# Altium schematic sheet Connectors.SchDoc
size A4 portrait
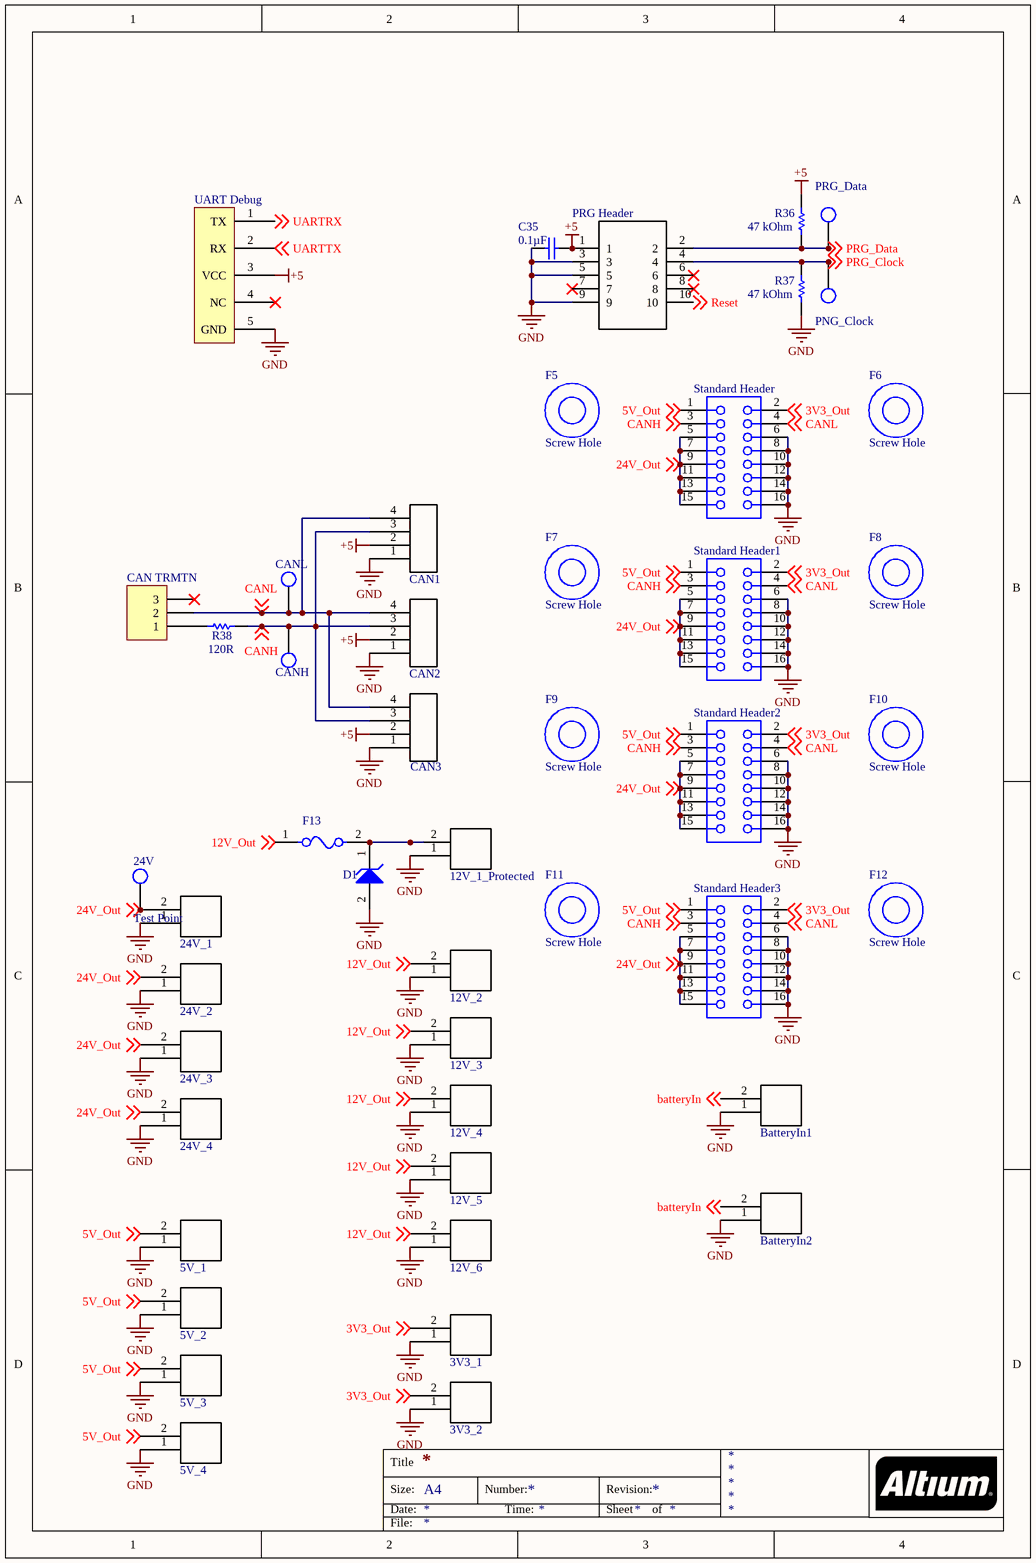
[diagram p0: Connectors.SchDoc]

## Parts
3V3_1  Molex 6.5MM  power connector  [power connector]  (value not drawn)
3V3_2  Molex 6.5MM  power connector  [power connector]  (value not drawn)
5V_1  Molex 6.5MM  power connector  [power connector]  (value not drawn)
5V_2  Molex 6.5MM  power connector  [power connector]  (value not drawn)
5V_3  Molex 6.5MM  power connector  [power connector]  (value not drawn)
5V_4  Molex 6.5MM  power connector  [power connector]  (value not drawn)
12V_1_Protected  Molex 6.5MM  power connector  [power connector]  (value not drawn)
12V_2  Molex 6.5MM  power connector  [power connector]  (value not drawn)
12V_3  Molex 6.5MM  power connector  [power connector]  (value not drawn)
12V_4  Molex 6.5MM  power connector  [power connector]  (value not drawn)
12V_5  Molex 6.5MM  power connector  [power connector]  (value not drawn)
12V_6  Molex 6.5MM  power connector  [power connector]  (value not drawn)
24V  Test Point  [Test Point Through-hole]
24V_1  Molex 6.5MM  power connector  [power connector]  (value not drawn)
24V_2  Molex 6.5MM  power connector  [power connector]  (value not drawn)
24V_3  Molex 6.5MM  power connector  [power connector]  (value not drawn)
24V_4  Molex 6.5MM  power connector  [power connector]  (value not drawn)
BatteryIn1  Super Saber  [Super Sabre]  (value not drawn)
BatteryIn2  Super Saber  [Super Sabre]  (value not drawn)
C35  Capacitance: 0.1µF  [Cap 0805]  (hidden comment: Capacitor 0805)
CAN1  Molex Micro  [microfit 4 pin]  (value not drawn)
CAN2  Molex Micro  [microfit 4 pin]  (value not drawn)
CAN3  Molex Micro  [microfit 4 pin]  (value not drawn)
CAN_TRMTN  Header 3  [HDR1X3]  (value not drawn)
CANH  Test Point  [Test Point Through-hole]  (value not drawn)
CANL  Test Point  [Test Point Through-hole]  (value not drawn)
D1  1SMB5928BT3G  [ONSC-SMB-2-403A-03_H_V]  (value not drawn)
F5  Screw Hole  [Screw Hole]
F6  Screw Hole  [Screw Hole]
F7  Screw Hole  [Screw Hole]
F8  Screw Hole  [Screw Hole]
F9  Screw Hole  [Screw Hole]
F10  Screw Hole  [Screw Hole]
F11  Screw Hole  [Screw Hole]
F12  Screw Hole  [Screw Hole]
F13  015402.5DRT  [FP-0154-MFG]  (value not drawn)
PNG_Clock  Test Point  [Test Point Through-hole]  (value not drawn)
PRG_Data  Test Point  [Test Point Through-hole]  (value not drawn)
PRG_Header  Programming Header  [programming3D]  (value not drawn)
R36  value 47 kOhm  [RESC0805(2012)_N]  (hidden comment: Resistor 0805)
R37  value 47 kOhm  [RESC0805(2012)_N]  (hidden comment: Resistor 0805)
R38  value 120R  [RESC0805(2012)_N]  (hidden comment: Resistor 0805)
Standard_Header  Stacking Header  [SMTC-SSQ-108-02-X-D]  (value not drawn)
Standard_Header1  Stacking Header  [SMTC-SSQ-108-02-X-D]  (value not drawn)
Standard_Header2  Stacking Header  [SMTC-SSQ-108-02-X-D]  (value not drawn)
Standard_Header3  Stacking Header  [SMTC-SSQ-108-02-X-D]  (value not drawn)
UART_Debug  UART Debuging Header  [UART Debugging Header]  (value not drawn)

## Nets
+5: C35.2 CAN1.2 CAN2.2 CAN3.2 PRG_Header.1 R36.2 UART_Debug.3(VCC)
GND: 3V3_1.1 3V3_2.1 5V_1.1 5V_2.1 5V_3.1 5V_4.1 12V_1_Protected.1 12V_2.1 12V_3.1 12V_4.1 12V_5.1 12V_6.1 24V_1.1 24V_2.1 24V_3.1 24V_4.1 BatteryIn1.1 BatteryIn2.1 C35.1 CAN1.1 CAN2.1 CAN3.1 D1.2(A) PRG_Header.3 PRG_Header.5 PRG_Header.9 R37.1 Standard_Header.6 Standard_Header.8 Standard_Header.10 Standard_Header.12 Standard_Header.14 Standard_Header.16 Standard_Header1.6 Standard_Header1.8 Standard_Header1.10 Standard_Header1.12 Standard_Header1.14 Standard_Header1.16 Standard_Header2.6 Standard_Header2.8 Standard_Header2.10 Standard_Header2.12 Standard_Header2.14 Standard_Header2.16 Standard_Header3.6 Standard_Header3.8 Standard_Header3.10 Standard_Header3.12 Standard_Header3.14 Standard_Header3.16 UART_Debug.5(GND)
3V3_Out: 3V3_1.2 3V3_2.2 Standard_Header.2 Standard_Header1.2 Standard_Header2.2 Standard_Header3.2 ; off-sheet 3V3_Out
5V_Out: 5V_1.2 5V_2.2 5V_3.2 5V_4.2 Standard_Header.1 Standard_Header1.1 Standard_Header2.1 Standard_Header3.1 ; off-sheet 5V_Out
12V_Out: 12V_2.2 12V_3.2 12V_4.2 12V_5.2 12V_6.2 F13.1 ; off-sheet 12V_Out
24V_Out: 24V.1 24V_1.2 24V_2.2 24V_3.2 24V_4.2 Standard_Header.5 Standard_Header.7 Standard_Header.9 Standard_Header.11 Standard_Header.13 Standard_Header.15 Standard_Header1.5 Standard_Header1.7 Standard_Header1.9 Standard_Header1.11 Standard_Header1.13 Standard_Header1.15 Standard_Header2.5 Standard_Header2.7 Standard_Header2.9 Standard_Header2.11 Standard_Header2.13 Standard_Header2.15 Standard_Header3.5 Standard_Header3.7 Standard_Header3.9 Standard_Header3.11 Standard_Header3.13 Standard_Header3.15 ; off-sheet 24V_Out
batteryIn: BatteryIn1.2 BatteryIn2.2 ; off-sheet batteryIn
CANH: CAN1.3 CAN2.3 CAN3.3 CANH.1 R38.2 Standard_Header.3 Standard_Header1.3 Standard_Header2.3 Standard_Header3.3 ; off-sheet CANH
CANL: CAN1.4 CAN2.4 CAN3.4 CAN_TRMTN.2 CANL.1 Standard_Header.4 Standard_Header1.4 Standard_Header2.4 Standard_Header3.4 ; off-sheet CANL
PRG_Clock: PNG_Clock.1 PRG_Header.4 R37.2 ; off-sheet PRG_Clock
PRG_Data: PRG_Data.1 PRG_Header.2 R36.1 ; off-sheet PRG_Data
Reset: PRG_Header.10 ; off-sheet Reset
UARTRX: UART_Debug.1(TX) ; off-sheet UARTRX
UARTTX: UART_Debug.2(RX) ; off-sheet UARTTX
Net12V_1_Protected_2: 12V_1_Protected.2 D1.1(K) F13.2
NetCAN_TRMTN_1: CAN_TRMTN.1 R38.1

Not connected (* = marked no-connect by the designer): CAN_TRMTN 3*; PRG_Header 6* 7* 8*; UART_Debug 4(NC)*

## Notes on the sheet
- Title
- Size:
- Date:
- A4
- Number:
- Time:
- Revision:
- Sheet
- of
- File:

## Library data of the parts
24V = CMP-012-0000-1: Source: Test Points.SchLib; Pin Count: 1; Design Item ID: Test Point; Component Type: Standard
C35 = Capacitor 0805: Standard Capacitor; Manufacturer: AVX; Tolerance (%): ±10%; Dielectric: X5R; Rated Voltage: 10V; Datasheet Version: 05/2016; Manufacturer URL: http://www.avx.com/; Package Description: 2-Pin Surface Mount Device, Body 2.01 x 1.25 mm; Mounting Technology: SurfaceMount; Case Size/Dimension: 0805; Package Reference: 0805; Datasheet URL: http://datasheets.avx.com/cx5r.pdf
CAN1-CAN3 = Molex micro-fit 4-pin (Single row schematic): Molex micro-fit 3.0 dual row header. P/N 0430450427
CAN_TRMTN = Header 3: Header, 3-Pin; LatestRevisionDate: 17-Jul-2002; LatestRevisionNote: Re-released for DXP Platform.; Publisher: Altium Limited
D1 = CMP-1060-00153-1: 3 W Zener Voltage Regulator, 2-Pin SMB, Pb-Free, Tape and Reel; Manufacturer: On Semiconductor; VZ Typ (V): 13; PackageDescription: 2-Pin Small Molded Package, J-Bend Lead, Body 4.33 x 3.625 mm; PackageVersion: Rev. H, 05/2011; ComponentLink1Description: Manufacturer URL; Mounting Technology: Surface Mount; ComponentLink1URL: http://www.onsemi.com/; ComponentLink2Description: Datasheet; ComponentLink3URL: http://www.onsemi.com/pub_link/Collateral/1SMB5913BT3-D.PDF; Packing: Tape and Reel; PackageReference: SMB-2-403A-03_H; ComponentLink2URL: http://www.onsemi.com/pub_link/Collateral/1SMB5913BT3-D.PDF; DatasheetVersion: Rev. 8; PartNumber: 1SMB5928BT3G; RoHS: Pb-Free; ComponentLink3Description: Package Specification
F5-F12 = Screw Hole: Add 4 of these to your design for screw hole mounting
F13 = CMP-2000-05609-2: FUSE BRD MNT 2.5A 125VAC/VDC SMD; Manufacturer: Littelfuse; Max Fuse Dc Voltage: 125V; Fuse Blow Speed: Slow; Temperature Range High: +125°C; Temperature Range Low: -55°C; Device Class L2: Fuses; Lead Free: Yes; Digikey Description: FUSE BRD MNT 2.5A 125VAC/VDC SMD; Category: Fuse; Fuse Current: 2.5A; Automotive: No; ComponentLink2URL: https://www.littelfuse.com/~/media/electronics/datasheets/fuses/littelfuse_fuse_154_154t_154l_154tl_datasheet.pdf.pdf; Mouser Description: Fuse Chip Slow Blow Acting 2.5A SMD Solder Pad 9.73 X 5.03 X 3.81mm T/R CSA/PSE/UL; Device Class L3: unset; RoHS: TRUE; Temperature: -55°C to +125°C; Max Fuse Ac Voltage: 125V; Package: 0154; Manufacturer Part Number: 015402.5DRT; Device Class L1: Circuit Protection; ComponentLink2Description: Datasheet; Octopart: https://octopart.com/015402.5drt-littelfuse-565920; Height: 3.81mm
R36 = Resistor 0805: Generic 0805 Resistor; Case-EIA: 0805; Tolerance: 5 %; Case-Metric: 2012; Power: 0.125 W; Technology: SMT
R37 = CMP-006-0001-1: Generic 0805 Resistor; Tolerance: 5 %; Power: 0.125 W; Case-EIA: 0805; Case-Metric: 2012; Design Item ID: Resistor 0805; Technology: SMT; Pin Count: 2; ComponentLink1Description: Digi-Key_Purchase_Link; ComponentLink2Description: Datasheet Link; Component Type: Standard; Digi-Key_Part_Number: RHM120KCT-ND; ComponentLink1URL: https://www.digikey.com/product-detail/en/rohm-semiconductor/ESR10EZPJ121/RHM120KCT-ND/1762959; ComponentLink2URL: https://d1d2qsbl8m0m72.cloudfront.net/en/products/databook/datasheet/passive/resistor/chip_resistor/esr-e.pdf; Source: CAN Termination Resistor 0805.SchLib
R38 = Resistor 0805: Generic 0805 Resistor; Tolerance: 5 %; Case-Metric: 2012; Case-EIA: 0805; Power: 0.125 W; Technology: SMT
Standard_Header Standard_Header1-Standard_Header3 = Stacking Header: SQ Post Socket, Through-hole, Vertical, -55 to 125 degC, 2.54 mm Pitch, 16-Pin, Female, RoHS; Manufacturer: Samtec; PartNumber: SSQ-108-02-G-D; Pitch: 2.54 mm; ComponentLink2URL: http://www.samtec.com/documents/webfiles/pdf/SSQ_TH.PDF; ComponentLink3Description: Package Specification; Mounting Technology: Through-hole; RoHS: True; PackageReference: SSQ-108-02-X-D; Orientation: Vertical; ComponentLink1URL: http://www.samtec.com; DatasheetVersion: F-214; Temperature Range: -55 to 125 degC; PackageDescription: Assembly, Socket Strip .025[0.64] SQ Tail; PackageVersion: BD, 6/1987; ComponentLink2Description: Datasheet; ComponentLink1Description: Manufacturer URL; ComponentLink3URL: http://www.samtec.com/documents/webfiles/cpdf/SSQ-1XX-XX-XXX-X-XX-XXX-XX-X-MKT.pdf